# Altium schematic sheet Power.SchDoc: Power: 7805 + AMS1117-3.3 en cascada (ejemplo 08)
size A4; Author: Efrain Alvarado; CompanyName: Universidad de Cuenca - MCIE; DrawnBy: Efrain Alvarado; DocumentNumber: E08-P; Revision: 1.0; SheetNumber: 1; SheetTotal: 1
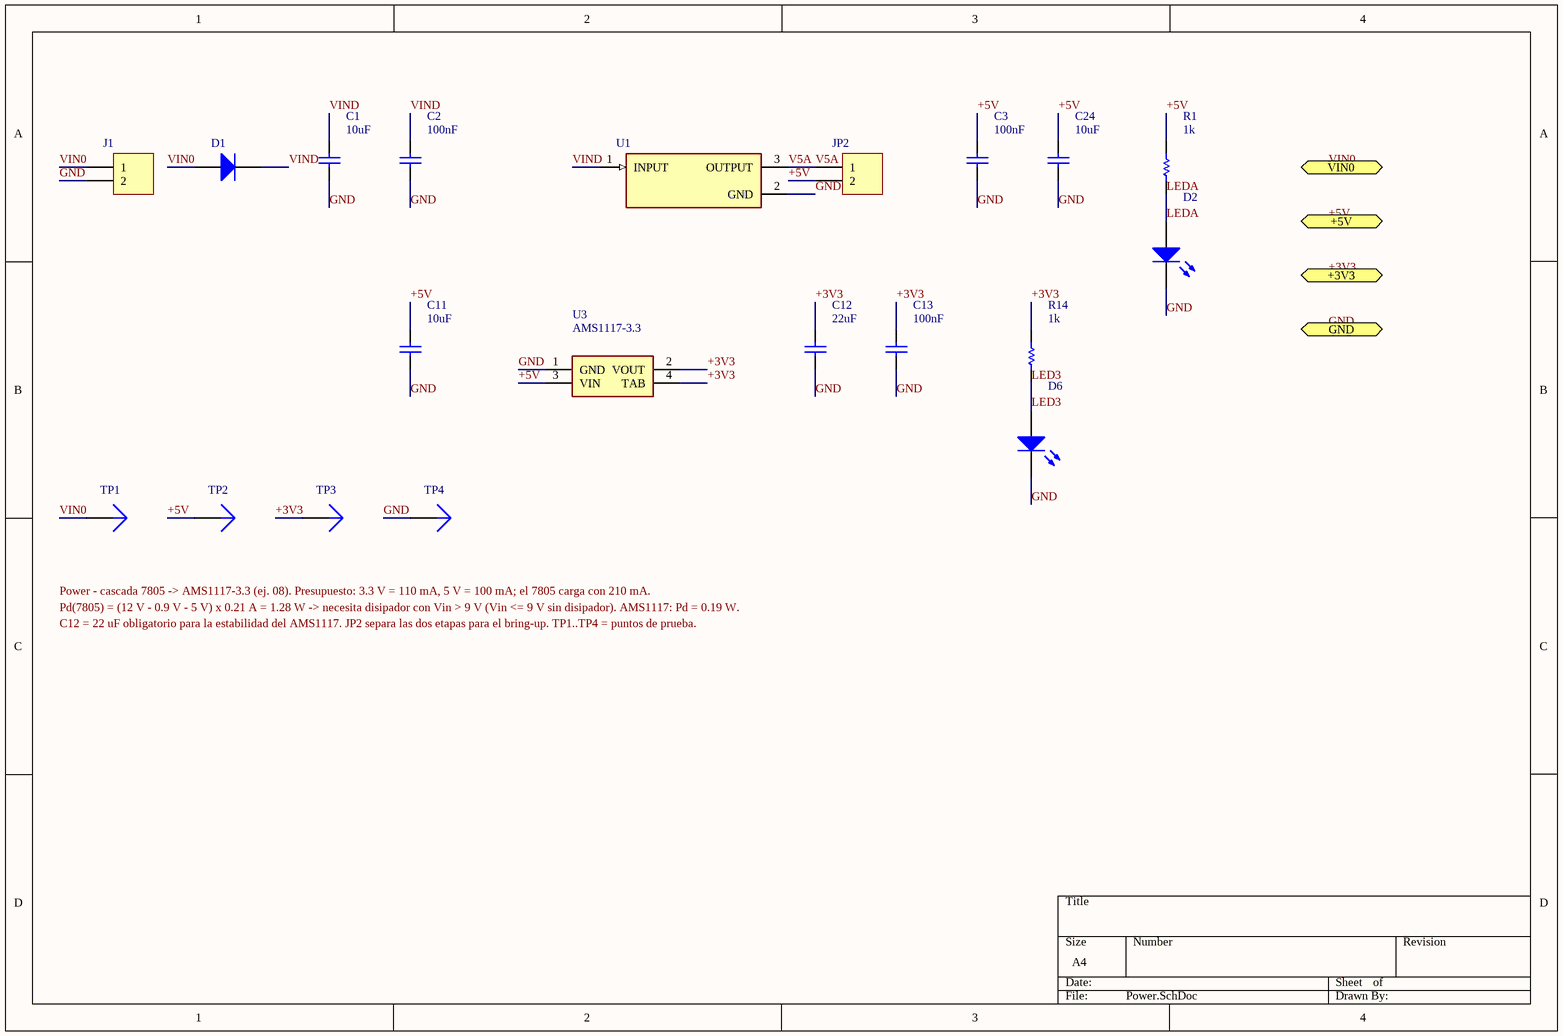
[diagram p0: Power.SchDoc]

## Parts
C1  value 10uF  [C0805]  (hidden comment: Cap)
C2  value 100nF  [0603]  (hidden comment: Cap)
C3  value 100nF  [0603]  (hidden comment: Cap)
C11  value 10uF  [C0805]  (hidden comment: Cap)
C12  value 22uF  [C1206]  (hidden comment: Cap)
C13  value 100nF  [0603]  (hidden comment: Cap)
C24  value 10uF  [C0805]  (hidden comment: Cap)
D1  Diode 1N4007  [DO-41]  (value not drawn)
D2  LED1  [LED-1]  (value not drawn)
D6  LED1  [LED-1]  (value not drawn)
J1  Header 2  [HDR1X2]  (value not drawn)
JP2  Header 2  [HDR1X2]  (value not drawn)
R1  value 1k  [0603]  (hidden comment: Res1)
R14  value 1k  [0603]  (hidden comment: Res1)
TP1  Plug  [PIN1]  (value not drawn)
TP2  Plug  [PIN1]  (value not drawn)
TP3  Plug  [PIN1]  (value not drawn)
TP4  Plug  [PIN1]  (value not drawn)
U1  LM7805T  [TO254P1011X457X1950-3]  (value not drawn)
U3  AMS1117-3.3  [SOT223_N]

## Ports
+3V3, +5V, GND, VIN0

## Nets
+3V3: C12.2 C13.2 R14.2 TP3.1 U3.2(VOUT) U3.4(TAB) ; port +3V3
+5V: C3.2 C11.2 C24.2 JP2.2 R1.2 TP2.1 U3.3(VIN) ; port +5V
GND: C1.1 C2.1 C3.1 C11.1 C12.1 C13.1 C24.1 D2.2(K) D6.2(K) J1.2 TP4.1 U1.2(GND) U3.1(GND) ; port GND
LED3: D6.1(A) R14.1
LEDA: D2.1(A) R1.1
V5A: JP2.1 U1.3(OUTPUT)
VIN0: D1.1(A) J1.1 TP1.1 ; port VIN0
VIND: C1.2 C2.2 D1.2(K) U1.1(INPUT)

## Notes on the sheet
- Power - cascada 7805 -> AMS1117-3.3 (ej. 08). Presupuesto: 3.3 V = 110 mA, 5 V = 100 mA; el 7805 carga con 210 mA.
- Pd(7805) = (12 V - 0.9 V - 5 V) x 0.21 A = 1.28 W -> necesita disipador con Vin > 9 V (Vin <= 9 V sin disipador). AMS1117: Pd = 0.19 W.
- C12 = 22 uF obligatorio para la estabilidad del AMS1117. JP2 separa las dos etapas para el bring-up. TP1..TP4 = puntos de prueba.

## Library data of the parts
C1 C11 C24 = Cap: Capacitor 10uF; Manufacturer: KEMET; Manufacturer Part Number: C0805C10610uF; Published: 8-Jun-2000; LatestRevisionDate: 17-Jul-2002; LatestRevisionNote: Re-released for DXP Platform.; PackageReference: RAD-0.3; Publisher: Altium Limited; PackageDescription: Radial Cap, Thru-Hole; 2 Leads; 0.3 in Pin Spacing
C2 C3 C13 = Cap: Capacitor 100nF; Manufacturer: KEMET; Manufacturer Part Number: C0603C100nF; Published: 8-Jun-2000; LatestRevisionDate: 17-Jul-2002; LatestRevisionNote: Re-released for DXP Platform.; PackageReference: RAD-0.3; Publisher: Altium Limited; PackageDescription: Radial Cap, Thru-Hole; 2 Leads; 0.3 in Pin Spacing
C12 = Cap: Capacitor 22uF; Manufacturer: KEMET; Manufacturer Part Number: C1206C22622uF; Published: 8-Jun-2000; LatestRevisionDate: 17-Jul-2002; LatestRevisionNote: Re-released for DXP Platform.; PackageReference: RAD-0.3; Publisher: Altium Limited; PackageDescription: Radial Cap, Thru-Hole; 2 Leads; 0.3 in Pin Spacing
D1 = Diode 1N4007: Proteccion de polaridad inversa; Manufacturer: Diodes Inc.; Published: 8-Jun-2000; LatestRevisionDate: 17-Jul-2002; LatestRevisionNote: Re-released for DXP Platform.; DatasheetVersion: 1998; PackageVersion: Aug-1999; PackageReference: DO-41; Publisher: Altium Limited; PackageDescription: Diode, Axial; Body 5.2 x 2.7 mm (LxDia. max), Lead Dia. 0.86 mm (max); Code_JEDEC: DO-204-AL; ComponentLink1Description: Manufacturer Link; ComponentLink1URL: http://www.fairchildsemi.com/; ComponentLink2Description: Datasheet; ComponentLink2URL: http://www.fairchildsemi.com/ds/1N%2F1N4001.pdf; Manufacturer Part Number: 1N4007
D2 = LED1: LED de alimentacion (5 V); Manufacturer: Kingbright; Manufacturer Part Number: WP7113ID; Published: 8-Jun-2000; LatestRevisionDate: 08-Jul-2005; LatestRevisionNote: Mech Layer 1 removed.; PackageReference: LED-1; Publisher: Altium Limited; PackageDescription: LED; 2 Leads
D6 = LED1: LED de alimentacion (3.3 V); Manufacturer: Kingbright; Manufacturer Part Number: WP7113GD; Published: 8-Jun-2000; LatestRevisionDate: 08-Jul-2005; LatestRevisionNote: Mech Layer 1 removed.; PackageReference: LED-1; Publisher: Altium Limited; PackageDescription: LED; 2 Leads
J1 = Header 2: Entrada 9-12 V DC: pin1 VIN, pin2 GND; Manufacturer: Generic; Manufacturer Part Number: Pin header 1x2 / borne; LatestRevisionDate: 17-Jul-2002; LatestRevisionNote: Re-released for DXP Platform.; Publisher: Altium Limited
JP2 = Header 2: Jumper de separacion entre etapas; Manufacturer: Generic; Manufacturer Part Number: Pin header 1x2; LatestRevisionDate: 17-Jul-2002; LatestRevisionNote: Re-released for DXP Platform.; Publisher: Altium Limited
R1 R14 = Res1: Resistor 1k 0603; Manufacturer: Yageo; Manufacturer Part Number: RC0603FR-071K; Published: 8-Jun-2000; LatestRevisionDate: 17-Jul-2002; LatestRevisionNote: Re-released for DXP Platform.; PackageReference: AXIAL-0.3; Publisher: Altium Limited; PackageDescription: Axial Device, Thru-Hole; 2 Leads; 0.3 in Pin Spacing
TP1 = Plug: Punto de prueba VIN0; Manufacturer: Generic; Manufacturer Part Number: Test point; LatestRevisionDate: 17-Jul-2002; LatestRevisionNote: Re-released for DXP Platform.; Publisher: Altium Limited
TP2 = Plug: Punto de prueba +5V; Manufacturer: Generic; Manufacturer Part Number: Test point; LatestRevisionDate: 17-Jul-2002; LatestRevisionNote: Re-released for DXP Platform.; Publisher: Altium Limited
TP3 = Plug: Punto de prueba +3V3; Manufacturer: Generic; Manufacturer Part Number: Test point; LatestRevisionDate: 17-Jul-2002; LatestRevisionNote: Re-released for DXP Platform.; Publisher: Altium Limited
TP4 = Plug: Punto de prueba GND; Manufacturer: Generic; Manufacturer Part Number: Test point; LatestRevisionDate: 17-Jul-2002; LatestRevisionNote: Re-released for DXP Platform.; Publisher: Altium Limited
U1 = LM7805T: Regulador 5 V, 1.5 A, TO-220 (necesita disipador si Vin>9 V); Manufacturer: STMicroelectronics; Manufacturer Part Number: L7805CV; MF: TAEJIN; SnapEDA_Link: https://www.snapeda.com/parts/LM7805T/TAEJIN/view-part/?ref=snap; Package: TO-220-3 TAEJIN; Value: *; MP: LM7805T; Check_prices: https://www.snapeda.com/parts/LM7805T/TAEJIN/view-part/?ref=eda
U3 = AMS1117-3.3: LDO 3.3 V 1 A SOT-223; Manufacturer: Advanced Monolithic Systems; Manufacturer Part Number: AMS1117-3.3